# Altium schematic sheet USER_IF.SchDoc
size A4; SheetNumber: 4; SheetTotal: 7; SheetSize: A4; DrawingNumber: SCH-001
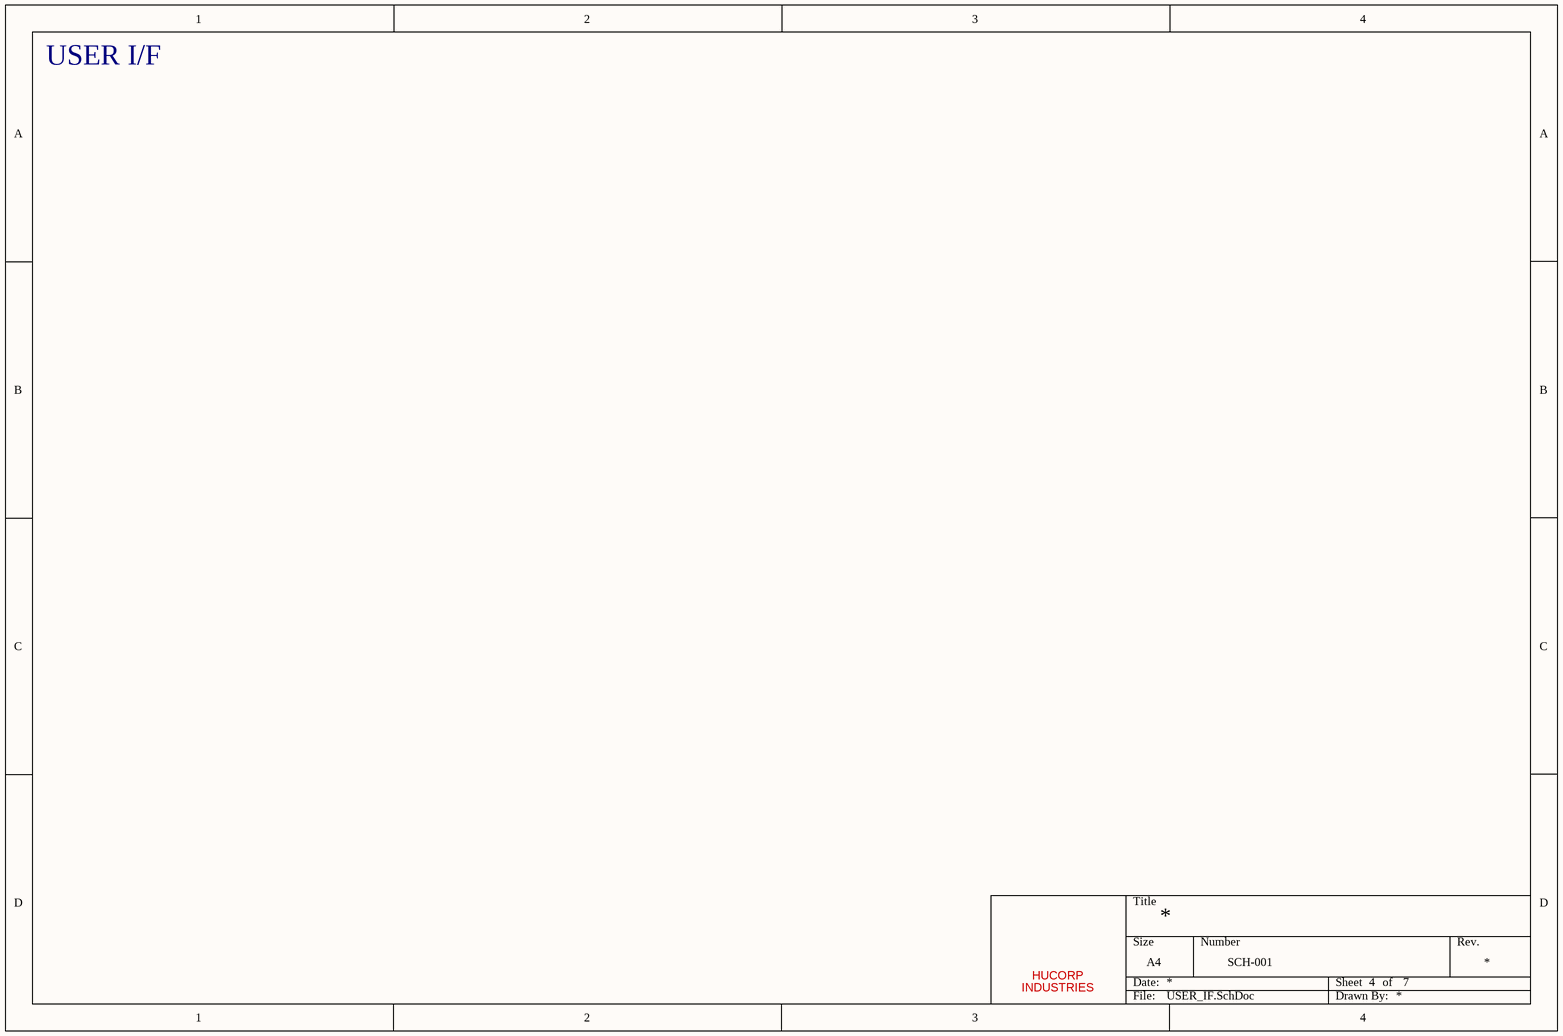
[diagram p0: USER_IF.SchDoc]

## Parts
*  HUCORP  (value not drawn)  (graphical)

## Notes on the sheet
- USER I/F
- (in symbol TitleBlock1) Title; Size; Number; Rev.; INDUSTRIES; Date:; Sheet; of; File:; Drawn By:

## Library data of the parts
* = TitleBlock1: HUCORP Title Block